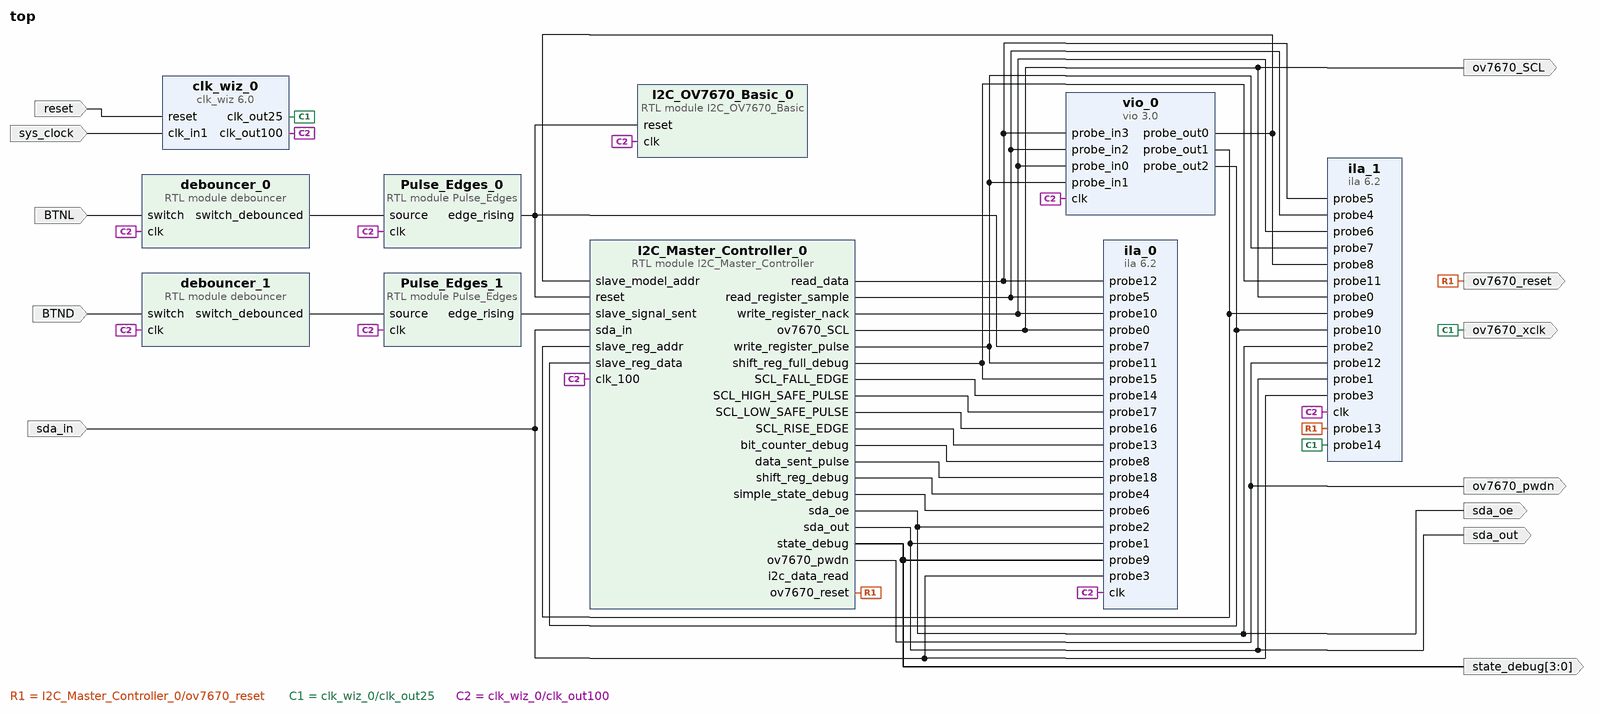
[diagram p0: block diagram of the top level]
# Vivado block design top, xc7a35tcpg236-1, Vivado 2023.2
create_bd_design top

create_bd_port -dir I -type clk sys_clock
set_property -dict {CONFIG.FREQ_HZ 100000000 CONFIG.PHASE 0.0} [get_bd_ports sys_clock]
create_bd_port -dir I -type rst reset
set_property -dict {CONFIG.POLARITY ACTIVE_HIGH} [get_bd_ports reset]
create_bd_port -dir I BTNL
create_bd_port -dir O ov7670_SCL
create_bd_port -dir O ov7670_pwdn
create_bd_port -dir O -type rst ov7670_reset
create_bd_port -dir O -type clk ov7670_xclk
create_bd_port -dir I sda_in
create_bd_port -dir O sda_out
create_bd_port -dir O sda_oe
create_bd_port -dir I BTND
create_bd_port -dir O -from 3 -to 0 state_debug

create_bd_cell -type ip -vlnv xilinx.com:ip:clk_wiz:6.0 clk_wiz_0
set_property -dict [list \
  CONFIG.CLKOUT1_DRIVES BUFG \
  CONFIG.CLKOUT1_JITTER 137.681 \
  CONFIG.CLKOUT1_PHASE_ERROR 105.461 \
  CONFIG.CLKOUT2_DRIVES BUFG \
  CONFIG.CLKOUT2_JITTER 183.467 \
  CONFIG.CLKOUT2_PHASE_ERROR 105.461 \
  CONFIG.CLKOUT2_REQUESTED_OUT_FREQ 25 \
  CONFIG.CLKOUT2_USED true \
  CONFIG.CLKOUT3_DRIVES BUFG \
  CONFIG.CLKOUT4_DRIVES BUFG \
  CONFIG.CLKOUT5_DRIVES BUFG \
  CONFIG.CLKOUT6_DRIVES BUFG \
  CONFIG.CLKOUT7_DRIVES BUFG \
  CONFIG.CLK_IN1_BOARD_INTERFACE sys_clock \
  CONFIG.CLK_OUT1_PORT clk_out100 \
  CONFIG.CLK_OUT2_PORT clk_out25 \
  CONFIG.MMCM_BANDWIDTH OPTIMIZED \
  CONFIG.MMCM_CLKFBOUT_MULT_F 9 \
  CONFIG.MMCM_CLKOUT0_DIVIDE_F 9 \
  CONFIG.MMCM_CLKOUT1_DIVIDE 36 \
  CONFIG.MMCM_COMPENSATION ZHOLD \
  CONFIG.NUM_OUT_CLKS 2 \
  CONFIG.PRIMITIVE PLL \
  CONFIG.RESET_BOARD_INTERFACE reset \
  CONFIG.USE_BOARD_FLOW true \
] [get_bd_cells clk_wiz_0]
create_bd_cell -type module -reference debouncer debouncer_0
create_bd_cell -type ip -vlnv xilinx.com:ip:ila:6.2 ila_0
set_property -dict [list \
  CONFIG.C_DATA_DEPTH 1024 \
  CONFIG.C_MONITOR_TYPE Native \
  CONFIG.C_NUM_OF_PROBES 19 \
  CONFIG.C_PROBE12_WIDTH 8 \
  CONFIG.C_PROBE14_WIDTH 1 \
  CONFIG.C_PROBE15_WIDTH 8 \
  CONFIG.C_PROBE4_WIDTH 8 \
  CONFIG.C_PROBE5_WIDTH 1 \
  CONFIG.C_PROBE6_WIDTH 4 \
  CONFIG.C_PROBE7_WIDTH 1 \
  CONFIG.C_PROBE8_WIDTH 5 \
  CONFIG.C_PROBE9_WIDTH 4 \
] [get_bd_cells ila_0]
create_bd_cell -type module -reference Pulse_Edges Pulse_Edges_0
create_bd_cell -type module -reference I2C_Master_Controller I2C_Master_Controller_0
create_bd_cell -type module -reference I2C_OV7670_Basic I2C_OV7670_Basic_0
create_bd_cell -type module -reference Pulse_Edges Pulse_Edges_1
create_bd_cell -type module -reference debouncer debouncer_1
create_bd_cell -type ip -vlnv xilinx.com:ip:vio:3.0 vio_0
set_property -dict [list \
  CONFIG.C_NUM_PROBE_IN 4 \
  CONFIG.C_NUM_PROBE_OUT 3 \
  CONFIG.C_PROBE_OUT0_INIT_VAL 0x43 \
  CONFIG.C_PROBE_OUT0_WIDTH 8 \
  CONFIG.C_PROBE_OUT1_INIT_VAL 0x12 \
  CONFIG.C_PROBE_OUT1_WIDTH 8 \
  CONFIG.C_PROBE_OUT2_INIT_VAL 0x40 \
  CONFIG.C_PROBE_OUT2_WIDTH 8 \
] [get_bd_cells vio_0]
create_bd_cell -type ip -vlnv xilinx.com:ip:ila:6.2 ila_1
set_property -dict [list \
  CONFIG.C_DATA_DEPTH 1024 \
  CONFIG.C_MONITOR_TYPE Native \
  CONFIG.C_NUM_OF_PROBES 15 \
  CONFIG.C_PROBE10_WIDTH 8 \
  CONFIG.C_PROBE11_WIDTH 8 \
  CONFIG.C_PROBE5_WIDTH 8 \
  CONFIG.C_PROBE8_WIDTH 8 \
  CONFIG.C_PROBE9_WIDTH 8 \
] [get_bd_cells ila_1]

# ---- connections ----

connect_bd_net [get_bd_ports BTND] [get_bd_pins debouncer_1/switch]
connect_bd_net [get_bd_ports BTNL] [get_bd_pins debouncer_0/switch]
connect_bd_net [get_bd_pins I2C_Master_Controller_0/SCL_FALL_EDGE] [get_bd_pins ila_0/probe14]
connect_bd_net -net I2C_Master_Controller_0_SCL_HIGH_SAFE_SAMPLE [get_bd_pins I2C_Master_Controller_0/SCL_HIGH_SAFE_PULSE] [get_bd_pins ila_0/probe17]
connect_bd_net -net I2C_Master_Controller_0_SCL_LOW_SAFE_SAMPLE [get_bd_pins I2C_Master_Controller_0/SCL_LOW_SAFE_PULSE] [get_bd_pins ila_0/probe16]
connect_bd_net [get_bd_pins I2C_Master_Controller_0/SCL_RISE_EDGE] [get_bd_pins ila_0/probe13]
connect_bd_net [get_bd_pins I2C_Master_Controller_0/bit_counter_debug] [get_bd_pins ila_0/probe8]
connect_bd_net [get_bd_pins I2C_Master_Controller_0/data_sent_pulse] [get_bd_pins ila_0/probe18]
# net I2C_Master_Controller_0_i2c_data_read has one end: I2C_Master_Controller_0/i2c_data_read
connect_bd_net [get_bd_pins I2C_Master_Controller_0/read_data] [get_bd_pins ila_0/probe12] [get_bd_pins vio_0/probe_in3] [get_bd_pins ila_1/probe5]
connect_bd_net [get_bd_pins I2C_Master_Controller_0/read_register_sample] \
  [get_bd_pins ila_0/probe5] [get_bd_pins vio_0/probe_in2] [get_bd_pins ila_1/probe4]
connect_bd_net [get_bd_pins I2C_Master_Controller_0/shift_reg_debug] [get_bd_pins ila_0/probe4]
connect_bd_net [get_bd_pins I2C_Master_Controller_0/shift_reg_full_debug] [get_bd_pins ila_0/probe15] [get_bd_pins ila_1/probe11]
connect_bd_net [get_bd_pins I2C_Master_Controller_0/simple_state_debug] [get_bd_pins ila_0/probe6]
connect_bd_net [get_bd_pins I2C_Master_Controller_0/state_debug] [get_bd_pins ila_0/probe9] [get_bd_ports state_debug]
connect_bd_net [get_bd_pins I2C_Master_Controller_0/write_register_nack] \
  [get_bd_pins ila_0/probe10] [get_bd_pins vio_0/probe_in0] [get_bd_pins ila_1/probe6]
connect_bd_net [get_bd_pins I2C_Master_Controller_0/write_register_pulse] \
  [get_bd_pins ila_0/probe11] [get_bd_pins vio_0/probe_in1] [get_bd_pins ila_1/probe7]
connect_bd_net -net I2C_OV7670_Master_0_ov7670_SCL [get_bd_pins I2C_Master_Controller_0/ov7670_SCL] \
  [get_bd_ports ov7670_SCL] [get_bd_pins ila_0/probe0] [get_bd_pins ila_1/probe0]
connect_bd_net -net I2C_OV7670_Master_0_ov7670_pwdn [get_bd_pins I2C_Master_Controller_0/ov7670_pwdn] \
  [get_bd_ports ov7670_pwdn] [get_bd_pins ila_1/probe12]
connect_bd_net -net I2C_OV7670_Master_0_ov7670_reset [get_bd_pins I2C_Master_Controller_0/ov7670_reset] \
  [get_bd_ports ov7670_reset] [get_bd_pins ila_1/probe13]
connect_bd_net -net I2C_OV7670_Master_0_sda_oe [get_bd_pins I2C_Master_Controller_0/sda_oe] \
  [get_bd_ports sda_oe] [get_bd_pins ila_0/probe2] [get_bd_pins ila_1/probe2]
connect_bd_net -net I2C_OV7670_Master_0_sda_out [get_bd_pins I2C_Master_Controller_0/sda_out] \
  [get_bd_ports sda_out] [get_bd_pins ila_0/probe1] [get_bd_pins ila_1/probe1]
connect_bd_net [get_bd_pins Pulse_Edges_0/edge_rising] \
  [get_bd_pins ila_0/probe7] [get_bd_pins I2C_OV7670_Basic_0/reset] [get_bd_pins I2C_Master_Controller_0/reset]
connect_bd_net [get_bd_pins Pulse_Edges_1/edge_rising] [get_bd_pins I2C_Master_Controller_0/slave_signal_sent]
connect_bd_net [get_bd_pins clk_wiz_0/clk_out25] [get_bd_ports ov7670_xclk] [get_bd_pins ila_1/probe14]
connect_bd_net [get_bd_pins clk_wiz_0/clk_out100] \
  [get_bd_pins debouncer_0/clk] [get_bd_pins ila_0/clk] [get_bd_pins Pulse_Edges_0/clk] [get_bd_pins Pulse_Edges_1/clk] \
  [get_bd_pins I2C_OV7670_Basic_0/clk] [get_bd_pins debouncer_1/clk] [get_bd_pins vio_0/clk] \
  [get_bd_pins I2C_Master_Controller_0/clk_100] [get_bd_pins ila_1/clk]
connect_bd_net [get_bd_pins debouncer_0/switch_debounced] [get_bd_pins Pulse_Edges_0/source]
connect_bd_net [get_bd_pins debouncer_1/switch_debounced] [get_bd_pins Pulse_Edges_1/source]
connect_bd_net [get_bd_ports reset] [get_bd_pins clk_wiz_0/reset]
connect_bd_net [get_bd_ports sda_in] [get_bd_pins ila_0/probe3] [get_bd_pins I2C_Master_Controller_0/sda_in] [get_bd_pins ila_1/probe3]
connect_bd_net [get_bd_ports sys_clock] [get_bd_pins clk_wiz_0/clk_in1]
connect_bd_net [get_bd_pins vio_0/probe_out0] [get_bd_pins I2C_Master_Controller_0/slave_model_addr] [get_bd_pins ila_1/probe8]
connect_bd_net [get_bd_pins vio_0/probe_out1] [get_bd_pins I2C_Master_Controller_0/slave_reg_addr] [get_bd_pins ila_1/probe9]
connect_bd_net [get_bd_pins vio_0/probe_out2] [get_bd_pins I2C_Master_Controller_0/slave_reg_data] [get_bd_pins ila_1/probe10]

validate_bd_design
save_bd_design
